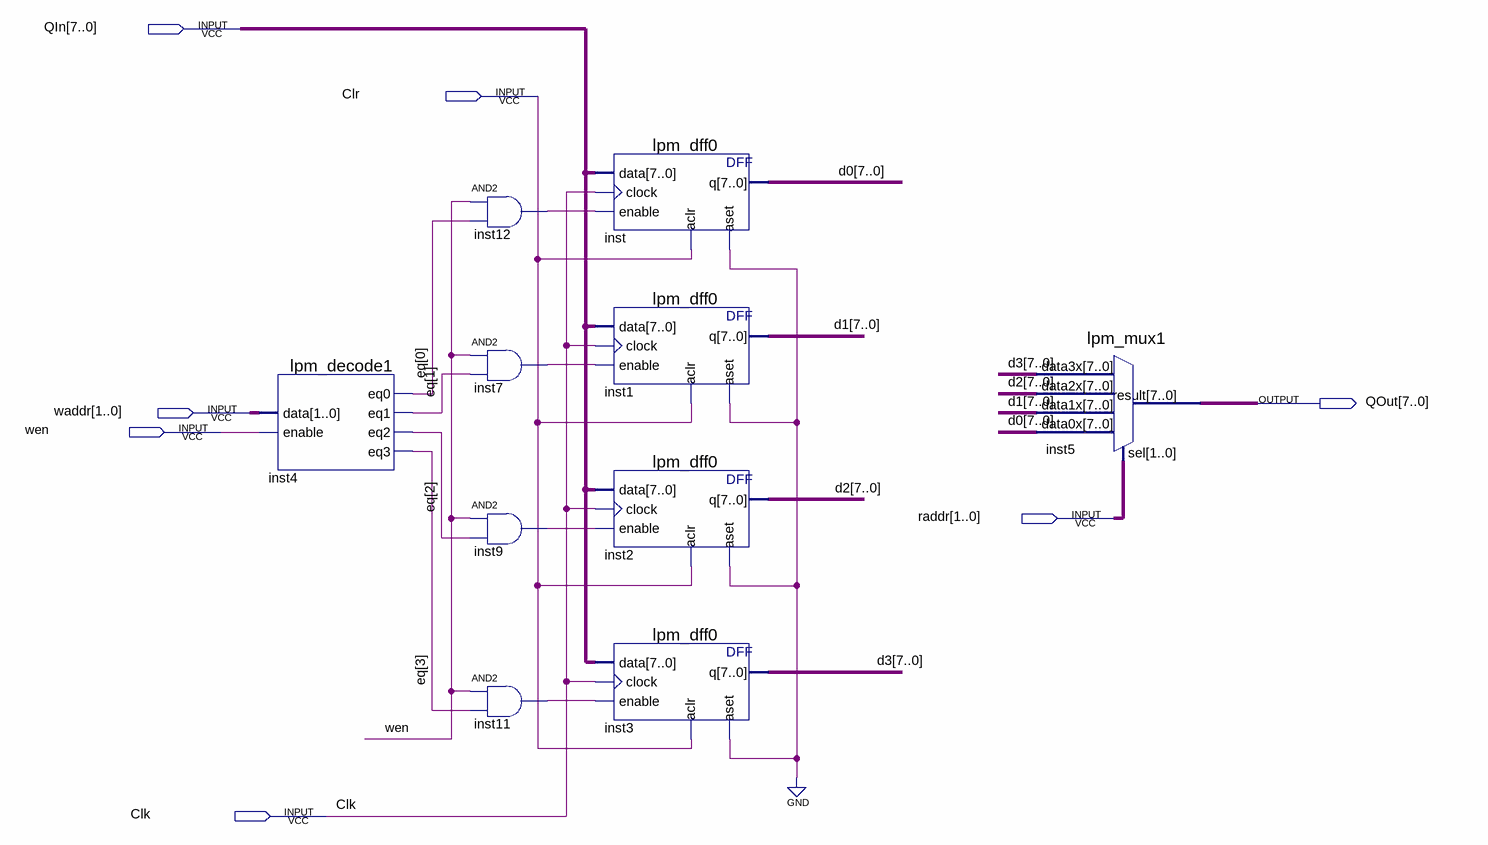
[diagram p0: schematic sheet]
// Quartus schematic REGS.bdf as structural Verilog: 10 symbols, 7 pins
module REGS (
  input  [7:0] QIn,
  input  Clr,
  input  [1:0] waddr,
  input  wen,
  input  [1:0] raddr,
  input  Clk,
  output [7:0] QOut
);

  wire inst7_out, inst9_out, inst11_out, inst12_out;
  wire [3:0] eq;
  wire [7:0] d0, d1, d2, d3;

  lpm_decode1 inst4 (.data(waddr), .enable(wen), .eq0(eq[0]), .eq1(eq[1]), .eq2(eq[2]), .eq3(eq[3]));
  and inst12 (inst12_out, wen, eq[0]);
  and inst7 (inst7_out, wen, eq[1]);
  and inst9 (inst9_out, wen, eq[2]);
  and inst11 (inst11_out, wen, eq[3]);
  lpm_dff0 inst (.data(QIn), .clock(Clk), .enable(inst12_out), .aclr(Clr), .aset(1'b0), .q(d0));
  lpm_dff0 inst1 (.data(QIn), .clock(Clk), .enable(inst7_out), .aclr(Clr), .aset(1'b0), .q(d1));
  lpm_dff0 inst2 (.data(QIn), .clock(Clk), .enable(inst9_out), .aclr(Clr), .aset(1'b0), .q(d2));
  lpm_dff0 inst3 (.data(QIn), .clock(Clk), .enable(inst11_out), .aclr(Clr), .aset(1'b0), .q(d3));
  lpm_mux1 inst5 (.data3x(d3), .data2x(d2), .data1x(d1), .data0x(d0), .sel(raddr), .result(QOut));
endmodule
